# EAGLE schematic VIC20_SExp (EAGLE 9.5.2)
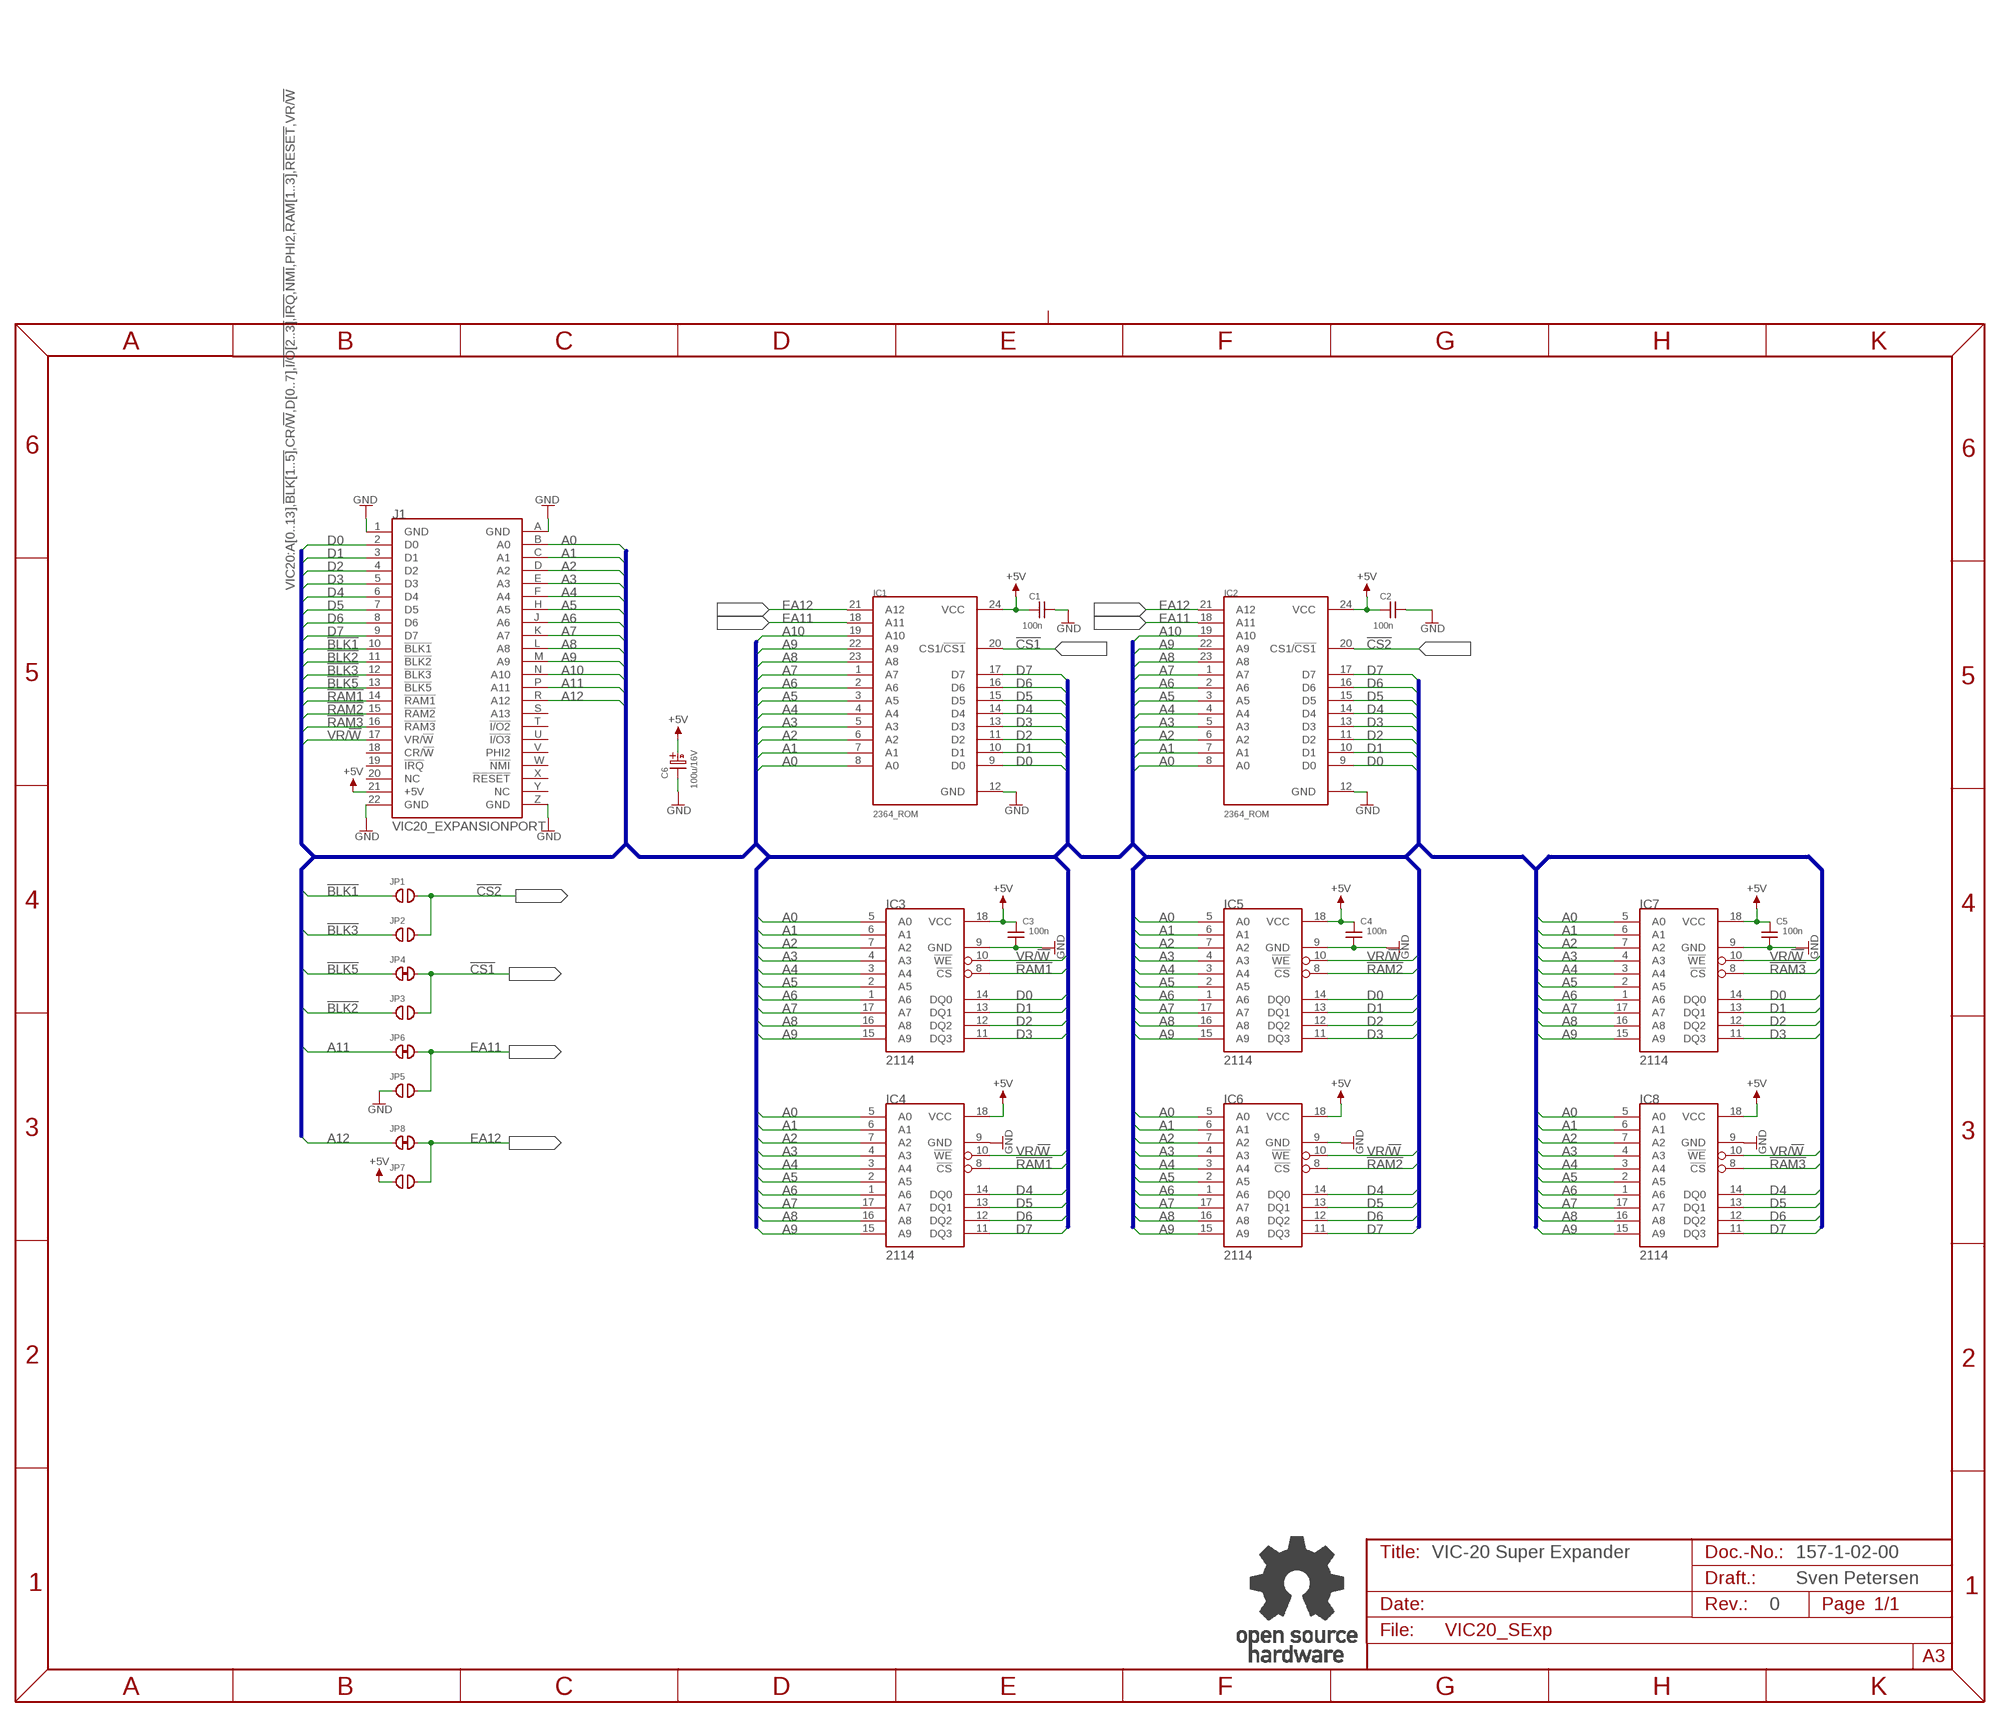
[diagram p0: schematic, sheet 1]

## Parts
C1  100n  CAP01  [C-2,5]
C2  100n  CAP01  [C-2,5]
C3  100n  CAP01  [C-2,5]
C4  100n  CAP01  [C-2,5]
C5  100n  CAP01  [C-2,5]
C6  100u/16V  C07/2,5  [C07/2,5]
IC1  2364_ROM  [DIL24-6]
IC2  2364_ROM  [DIL24-6]
IC3  2114  [DIL18]
IC4  2114  [DIL18]
IC5  2114  [DIL18]
IC6  2114  [DIL18]
IC7  2114  [DIL18]
IC8  2114  [DIL18]
J1  VIC20_EXPANSIONPORT  [VIC20_EXPANSION]
JP1  OPEN  [CP_OP]
JP2  OPEN  [CP_OP]
JP3  OPEN  [CP_OP]
JP4  CLOSED  [CP_CL]
JP5  OPEN  [CP_OP]
JP6  CLOSED  [CP_CL]
JP7  OPEN  [CP_OP]
JP8  CLOSED  [CP_CL]
U$2  OPEN_SOURCE_HW  [OPENHW]

## Nets
!BLK1: J1.10(!BLK1) JP1.1
!BLK2: J1.11(!BLK2) JP3.1
!BLK3: J1.12(!BLK3) JP2.1
!BLK5: J1.13(!BLK5) JP4.1
!CS1: IC1.20(CS1/!CS1) JP3.2 JP4.2
!CS2: IC2.20(CS1/!CS1) JP1.2 JP2.2
!RAM1: IC3.8(!CS) IC4.8(!CS) J1.14(!RAM1)
!RAM2: IC5.8(!CS) IC6.8(!CS) J1.15(!RAM2)
!RAM3: IC7.8(!CS) IC8.8(!CS) J1.16(!RAM3)
+5V: C1.1 C2.1 C3.2 C4.2 C5.2 C6.A(+) IC1.24(VCC) IC2.24(VCC) IC3.18(VCC) IC4.18(VCC) IC5.18(VCC) IC6.18(VCC) IC7.18(VCC) IC8.18(VCC) J1.21(+5V) JP7.1
A0: IC1.8(A0) IC2.8(A0) IC3.5(A0) IC4.5(A0) IC5.5(A0) IC6.5(A0) IC7.5(A0) IC8.5(A0) J1.B(A0)
A1: IC1.7(A1) IC2.7(A1) IC3.6(A1) IC4.6(A1) IC5.6(A1) IC6.6(A1) IC7.6(A1) IC8.6(A1) J1.C(A1)
A2: IC1.6(A2) IC2.6(A2) IC3.7(A2) IC4.7(A2) IC5.7(A2) IC6.7(A2) IC7.7(A2) IC8.7(A2) J1.D(A2)
A3: IC1.5(A3) IC2.5(A3) IC3.4(A3) IC4.4(A3) IC5.4(A3) IC6.4(A3) IC7.4(A3) IC8.4(A3) J1.E(A3)
A4: IC1.4(A4) IC2.4(A4) IC3.3(A4) IC4.3(A4) IC5.3(A4) IC6.3(A4) IC7.3(A4) IC8.3(A4) J1.F(A4)
A5: IC1.3(A5) IC2.3(A5) IC3.2(A5) IC4.2(A5) IC5.2(A5) IC6.2(A5) IC7.2(A5) IC8.2(A5) J1.H(A5)
A6: IC1.2(A6) IC2.2(A6) IC3.1(A6) IC4.1(A6) IC5.1(A6) IC6.1(A6) IC7.1(A6) IC8.1(A6) J1.J(A6)
A7: IC1.1(A7) IC2.1(A7) IC3.17(A7) IC4.17(A7) IC5.17(A7) IC6.17(A7) IC7.17(A7) IC8.17(A7) J1.K(A7)
A8: IC1.23(A8) IC2.23(A8) IC3.16(A8) IC4.16(A8) IC5.16(A8) IC6.16(A8) IC7.16(A8) IC8.16(A8) J1.L(A8)
A9: IC1.22(A9) IC2.22(A9) IC3.15(A9) IC4.15(A9) IC5.15(A9) IC6.15(A9) IC7.15(A9) IC8.15(A9) J1.M(A9)
A10: IC1.19(A10) IC2.19(A10) J1.N(A10)
A11: J1.P(A11) JP6.1
A12: J1.R(A12) JP8.1
D0: IC1.9(D0) IC2.9(D0) IC3.14(DQ0) IC5.14(DQ0) IC7.14(DQ0) J1.2(D0)
D1: IC1.10(D1) IC2.10(D1) IC3.13(DQ1) IC5.13(DQ1) IC7.13(DQ1) J1.3(D1)
D2: IC1.11(D2) IC2.11(D2) IC3.12(DQ2) IC5.12(DQ2) IC7.12(DQ2) J1.4(D2)
D3: IC1.13(D3) IC2.13(D3) IC3.11(DQ3) IC5.11(DQ3) IC7.11(DQ3) J1.5(D3)
D4: IC1.14(D4) IC2.14(D4) IC4.14(DQ0) IC6.14(DQ0) IC8.14(DQ0) J1.6(D4)
D5: IC1.15(D5) IC2.15(D5) IC4.13(DQ1) IC6.13(DQ1) IC8.13(DQ1) J1.7(D5)
D6: IC1.16(D6) IC2.16(D6) IC4.12(DQ2) IC6.12(DQ2) IC8.12(DQ2) J1.8(D6)
D7: IC1.17(D7) IC2.17(D7) IC4.11(DQ3) IC6.11(DQ3) IC8.11(DQ3) J1.9(D7)
EA11: IC1.18(A11) IC2.18(A11) JP5.2 JP6.2
EA12: IC1.21(A12) IC2.21(A12) JP7.2 JP8.2
GND: C1.2 C2.2 C3.1 C4.1 C5.1 C6.K(-) IC1.12(GND) IC2.12(GND) IC3.9(GND) IC4.9(GND) IC5.9(GND) IC6.9(GND) IC7.9(GND) IC8.9(GND) J1.1(GND) J1.22(GND) J1.A(GND) J1.Z(GND) JP5.1
VR/!W: IC3.10(!WE) IC4.10(!WE) IC5.10(!WE) IC6.10(!WE) IC7.10(!WE) IC8.10(!WE) J1.17(VR/!W)
Unconnected: J1.18(CR/!W) J1.19(!IRQ) J1.S(A13) J1.T(!I/O2) J1.U(!I/O3) J1.V(PHI2) J1.W(!NMI) J1.X(!RESET) J1.Y(NC)

## Buses
VIC20:A[0..13],!BLK[1..5],CR/!W,D[0..7],!I/O[2..3],!IRQ,!NMI,PHI2,!RAM[1..3],!RESET,VR/!W

## Notes on the sheet
- VIC-20 Super Expander | 157-1-02-00
- Sven Petersen
- 0

## Power pins joined to a net without a drawn wire
NC: J1.20(NC)

## Library data of the parts
C1-C5 = DISCRETE:CAP01
C6 = ELCO:C07/2,5
IC1 IC2 = MOS:2364
IC3-IC8 = MOS:2114
J1 = Commodore:VIC20_EXPANSIONPORT
JP1-JP3 JP5 JP7 = Cutpad:OPEN: open Cutpad
JP4 JP6 JP8 = Cutpad:CLOSED: Closed Cutpad
U$2 = Logo:OPEN_SOURCE_HW